# Altium schematic sheet M032.SchDoc
size A4; SheetNumber: 3; SheetTotal: 4
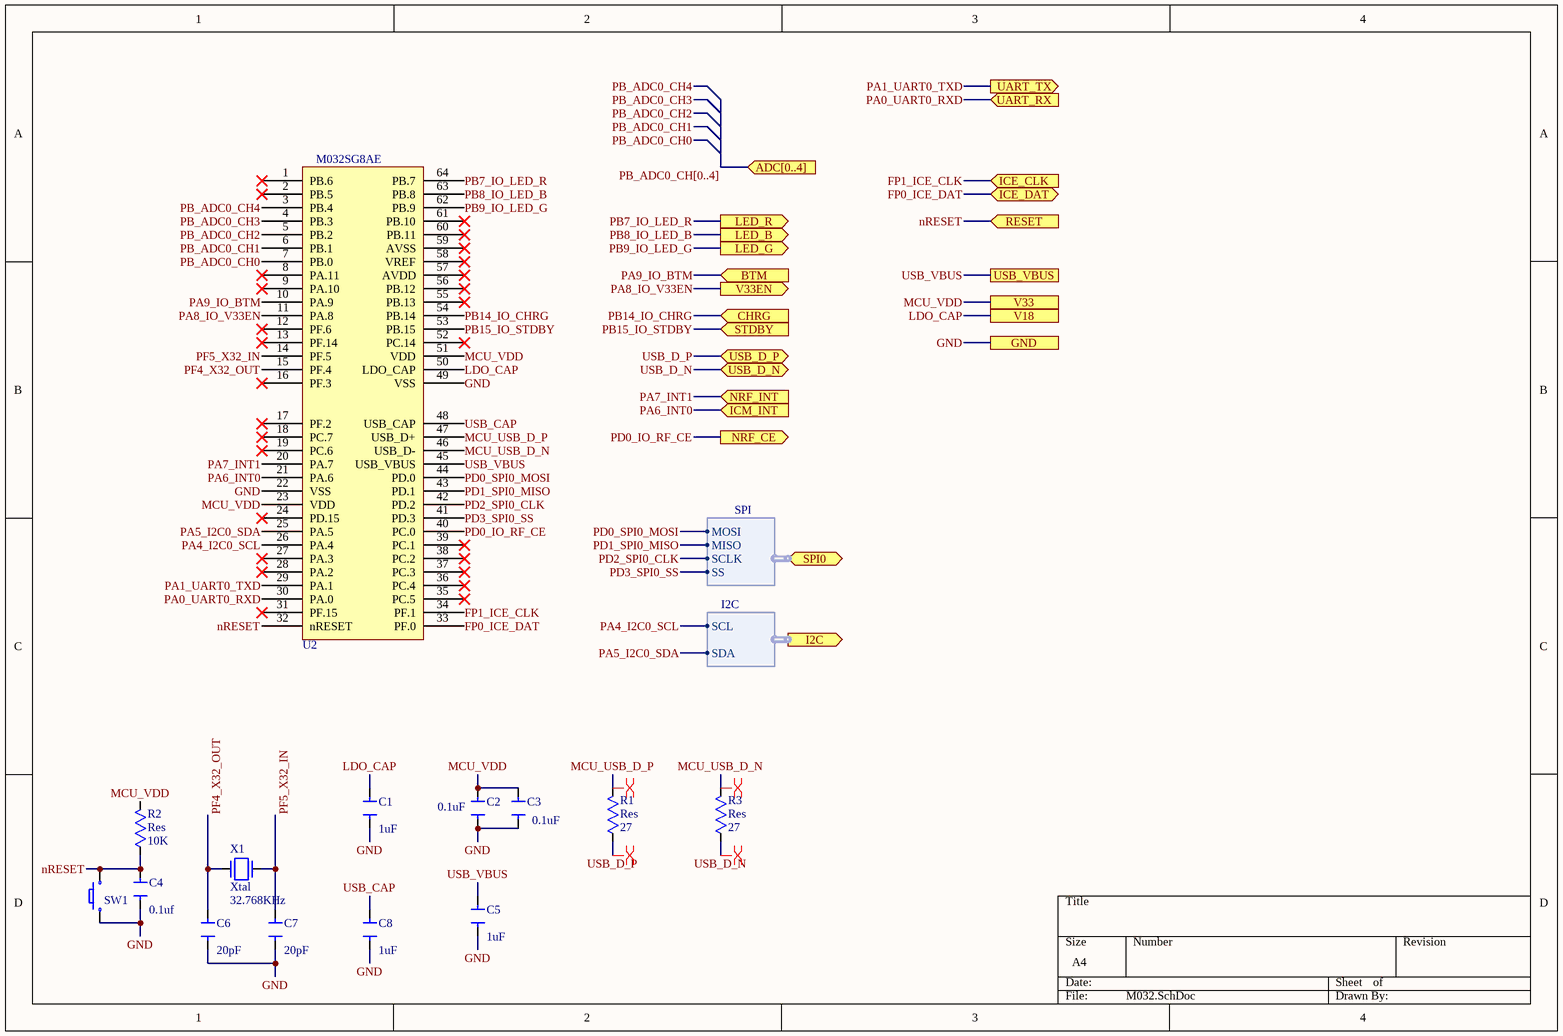
[diagram p0: M032.SchDoc]

## Parts
C1  value 1uF  [CAP_0402]  (hidden comment: Cap)
C2  value 0.1uF  [CAP_0402]  (hidden comment: Cap)
C3  value 0.1uF  [CAP_0402]  (hidden comment: Cap)
C4  value 0.1uf  [CAP_0402]  (hidden comment: Cap)
C5  value 1uF  [CAP_0402]  (hidden comment: Cap)
C6  value 20pF  [CAP_0402]  (hidden comment: Cap)
C7  value 20pF  [CAP_0402]  (hidden comment: Cap)
C8  value 1uF  [CAP_0402]  (hidden comment: Cap)
R1  Res  value 27  [RES_0402]
R2  Res  value 10K  [RES_0402]
R3  Res  value 27  [RES_0402]
SW1  SPST  [TACK-SW_SMD 2P 4x3mm_2]  (value not drawn)
U2  M032SG8AE  [MCU_LQFP_64_7x7]
X1  Xtal  value 32.768KHz  [X3215]

## Ports
ADC[0..4] (in), BTM (in), CHRG (in), GND, I2C (out, harness I2C), ICE_CLK (in), ICE_DAT (bidir), ICM_INT (in), LED_B (out), LED_G (out), LED_R (out), NRF_CE (out), NRF_INT (in), RESET (in), SPI0 (bidir, harness SPI), STDBY (in), UART_RX (in), UART_TX (out), USB_D_N (bidir), USB_D_P (bidir), USB_VBUS, V18, V33, V33EN (out)

## Harnesses
SPI: SS, SCLK, MISO, MOSI
I2C: SCL, SDA

## Nets
FP0_ICE_DAT: U2.33(PF.0) ; port ICE_DAT
FP1_ICE_CLK: U2.34(PF.1) ; port ICE_CLK
GND: C1.2 C2.2 C3.2 C4.2 C5.2 C6.2 C7.2 C8.2 SW1.2 U2.22(VSS) U2.49(VSS) ; port GND
LDO_CAP: C1.1 U2.50(LDO_CAP) ; port V18
MCU_USB_D_N: R3.1 U2.46(USB_D-)
MCU_USB_D_P: R1.1 U2.47(USB_D+)
MCU_VDD: C2.1 C3.1 R2.1 U2.23(VDD) U2.51(VDD) ; port V33
nRESET: C4.1 R2.2 SW1.1 U2.32(nRESET) ; port RESET
PA0_UART0_RXD: U2.30(PA.0) ; port UART_RX
PA1_UART0_TXD: U2.29(PA.1) ; port UART_TX
PA4_I2C0_SCL: U2.26(PA.4) ; port I2C.SCL
PA5_I2C0_SDA: U2.25(PA.5) ; port I2C.SDA
PA6_INT0: U2.21(PA.6) ; port ICM_INT
PA7_INT1: U2.20(PA.7) ; port NRF_INT
PA8_IO_V33EN: U2.11(PA.8) ; port V33EN
PA9_IO_BTM: U2.10(PA.9) ; port BTM
PB7_IO_LED_R: U2.64(PB.7) ; port LED_R
PB8_IO_LED_B: U2.63(PB.8) ; port LED_B
PB9_IO_LED_G: U2.62(PB.9) ; port LED_G
PB14_IO_CHRG: U2.54(PB.14) ; port CHRG
PB15_IO_STDBY: U2.53(PB.15) ; port STDBY
PB_ADC0_CH0: U2.7(PB.0)
PB_ADC0_CH1: U2.6(PB.1)
PB_ADC0_CH2: U2.5(PB.2)
PB_ADC0_CH3: U2.4(PB.3)
PB_ADC0_CH4: U2.3(PB.4)
PD0_IO_RF_CE: U2.40(PC.0) ; port NRF_CE
PD0_SPI0_MOSI: U2.44(PD.0) ; port SPI0.MOSI
PD1_SPI0_MISO: U2.43(PD.1) ; port SPI0.MISO
PD2_SPI0_CLK: U2.42(PD.2) ; port SPI0.SCLK
PD3_SPI0_SS: U2.41(PD.3) ; port SPI0.SS
PF4_X32_OUT: C6.1 U2.15(PF.4) X1.2
PF5_X32_IN: C7.1 U2.14(PF.5) X1.1
USB_CAP: C8.1 U2.48(USB_CAP)
USB_D_N: R3.2 ; port USB_D_N
USB_D_P: R1.2 ; port USB_D_P
USB_VBUS: C5.1 U2.45(USB_VBUS) ; port USB_VBUS

Not connected (* = marked no-connect by the designer): U2 1(PB.6)* 2(PB.5)* 8(PA.11)* 9(PA.10)* 12(PF.6)* 13(PF.14)* 16(PF.3)* 17(PF.2)* 18(PC.7)* 19(PC.6)* 24(PD.15)* 27(PA.3)* 28(PA.2)* 31(PF.15)* 35(PC.5)* 36(PC.4)* 37(PC.3)* 38(PC.2)* 39(PC.1)* 52(PC.14)* 55(PB.13)* 56(PB.12)* 57(AVDD)* 58(VREF)* 59(AVSS)* 60(PB.11)* 61(PB.10)*

## Buses and harness runs
bus PB_ADC0_CH[0..4] = port ADC[0..4]

## Layout directives
differential pair: MCU_USB_D_N, MCU_USB_D_P, USB_D_N, USB_D_P

## Library data of the parts
SW1 = Switch_Button1